# Altium project 项目.PrjPCB
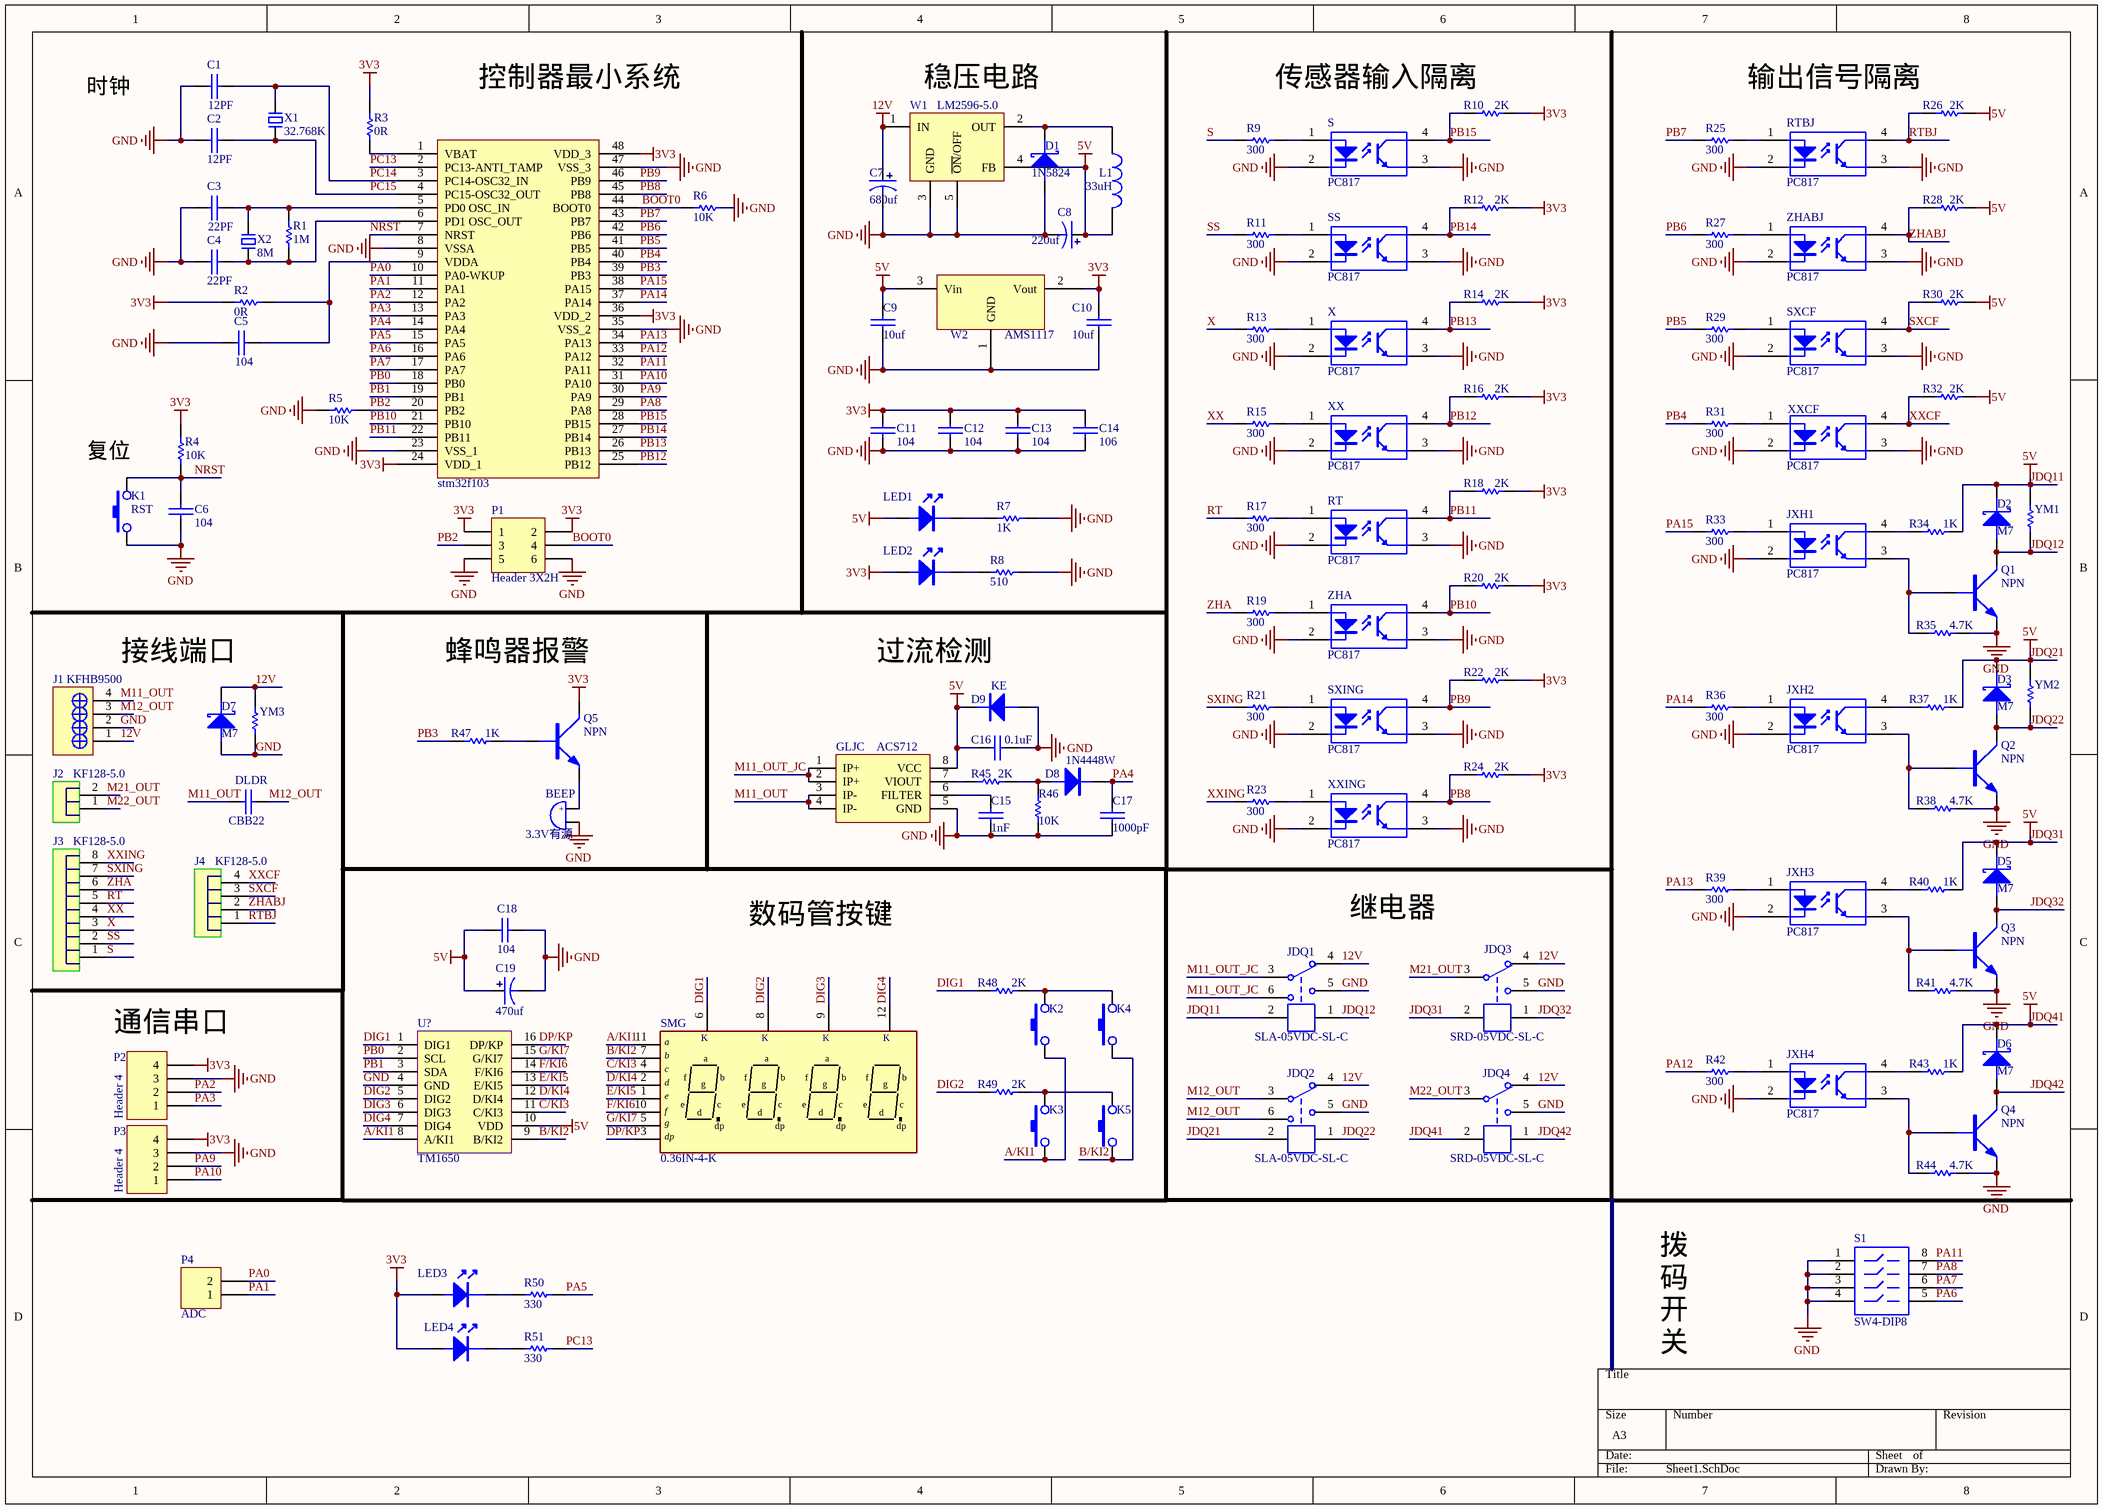
[diagram p0: Sheet1.SchDoc]
1 sheet, 135 parts. Net scope: global (net labels, ports and power ports of the same name join across sheets).
Board file: 项目.PcbDoc

## Sheet Sheet1.SchDoc
size A3

### Parts
?  stm32f103  [STM32F103_48_2]
BEEP  3.3V有源  [BEEP 5x9x5.5]
C1  12PF  [0805C]
C2  12PF  [0805C]
C3  22PF  [0805C]
C4  22PF  [0805C]
C5  104  [0805C]
C6  104  [0805C]
C7  680uf  [CM F(10*10.2)]
C8  220uf  [CM D(6.3*7.7)]
C9  10uf  [0805C]
C10  10uf  [0805C]
C11  104  [0805C]
C12  104  [0805C]
C13  104  [0805C]
C14  106  [0805C]
C15  1nF  [0805C]
C16  0.1uF  [0805C]
C17  1000pF  [0805C]
C18  104  [0805C]
C19  470uf  [CM E(8*10.2)]
D1  1N5824  [SMA/DO-214AC]
D2  M7  [SMA/DO-214AC]
D3  M7  [SMA/DO-214AC]
D5  M7  [SMA/DO-214AC]
D6  M7  [SMA/DO-214AC]
D7  M7  [SMA/DO-214AC]
D8  1N4448W  [SOD-123]
D9  KE  [SMB/DO-214AA]
DLDR  CBB22  [CBB 20*23*6]
GLJC  ACS712  [SOP8]
J1  KFHB9500  [KFHB9500-4P]
J2  KF128-5.0  [KF128-5.08-2P]
J3  KF128-5.0  [KF128-5.08-8P]
J4  KF128-5.0  [KF128-5.08-4P]
JDQ1  SLA-05VDC-SL-C  [SLA-xxVDC-SL-C]
JDQ2  SLA-05VDC-SL-C  [SLA-xxVDC-SL-C]
JDQ3  SRD-05VDC-SL-C  [SRD-C_B]
JDQ4  SRD-05VDC-SL-C  [SRD-C_B]
JXH1  PC817  [SMD_PC817]
JXH2  PC817  [SMD_PC817]
JXH3  PC817  [SMD_PC817]
JXH4  PC817  [SMD_PC817]
K1  RST  [SMD-3X6X2.5]
K2  (no value)  [SMD-3X6X2.5]
K3  (no value)  [SMD-3X6X2.5]
K4  (no value)  [SMD-3X6X2.5]
K5  (no value)  [SMD-3X6X2.5]
L1  33uH  [CDRH74]
LED1  (no value)  [LED-0805B]
LED2  (no value)  [LED-0805B]
LED3  (no value)  [LED-0805B]
LED4  (no value)  [LED-0805B]
P1  Header 3X2H  [HDR2.54-M-LS-2x3P]
P2  Header 4  [HDR2.54-LI-4P]
P3  Header 4  [HDR2.54-LI-4P]
P4  ADC  [HDR2.54-LI-2P]
Q1  NPN  [SOT-23]
Q2  NPN  [SOT-23]
Q3  NPN  [SOT-23]
Q4  NPN  [SOT-23]
Q5  NPN  [SOT-23]
R1  1M  [0805R]
R2  0R  [0805R]
R3  0R  [0805R]
R4  10K  [0805R]
R5  10K  [0805R]
R6  10K  [0805R]
R7  1K  [0805R]
R8  510  [0805R]
R9  300  [0805R]
R10  2K  [0805R]
R11  300  [0805R]
R12  2K  [0805R]
R13  300  [0805R]
R14  2K  [0805R]
R15  300  [0805R]
R16  2K  [0805R]
R17  300  [0805R]
R18  2K  [0805R]
R19  300  [0805R]
R20  2K  [0805R]
R21  300  [0805R]
R22  2K  [0805R]
R23  300  [0805R]
R24  2K  [0805R]
R25  300  [0805R]
R26  2K  [0805R]
R27  300  [0805R]
R28  2K  [0805R]
R29  300  [0805R]
R30  2K  [0805R]
R31  300  [0805R]
R32  2K  [0805R]
R33  300  [0805R]
R34  1K  [0805R]
R35  4.7K  [0805R]
R36  300  [0805R]
R37  1K  [0805R]
R38  4.7K  [0805R]
R39  300  [0805R]
R40  1K  [0805R]
R41  4.7K  [0805R]
R42  300  [0805R]
R43  1K  [0805R]
R44  4.7K  [0805R]
R45  2K  [0805R]
R46  10K  [0805R]
R47  1K  [0805R]
R48  2K  [0805R]
R49  2K  [0805R]
R50  330  [0805R]
R51  330  [0805R]
RT  PC817  [SMD_PC817]
RTBJ  PC817  [SMD_PC817]
S  PC817  [SMD_PC817]
S1  SW4-DIP8  [SMD-4P]
SMG  0.36IN-4-K  [0.36IN-4P]
SS  PC817  [SMD_PC817]
SXCF  PC817  [SMD_PC817]
SXING  PC817  [SMD_PC817]
U?  TM1650  [SOP16]
W1  LM2596-5.0  [TO263-5A]
W2  AMS1117  [SOT223]
X  PC817  [SMD_PC817]
X1  32.768K  [OSC-3x8-LI]
X2  8M  [OSC HC-49S]
XX  PC817  [SMD_PC817]
XXCF  PC817  [SMD_PC817]
XXING  PC817  [SMD_PC817]
YM1  (no value)  [VDR 9D-4.5]
YM2  (no value)  [VDR 9D-4.5]
YM3  (no value)  [VDR 9D-4.5]
ZHA  PC817  [SMD_PC817]
ZHABJ  PC817  [SMD_PC817]

### Nets
3V3: ?.24(VDD_1) ?.36(VDD_2) ?.48(VDD_3) C10.2 C11.2 C12.2 C13.2 C14.2 LED2.1(A) LED3.1(A) LED4.1(A) P1.1 P1.2 P2.4 P3.4 Q5.C R2.2 R3.1 R4.1 R10.2 R12.2 R14.2 R16.2 R18.2 R20.2 R22.2 R24.2 W2.2(Vout)
12V: C7.1 D7.K J1.1 JDQ1.4 JDQ2.4 JDQ3.4 JDQ4.4 W1.1(IN) YM3.2
GND: ?.8(VSSA) ?.23(VSS_1) ?.35(VSS_2) ?.47(VSS_3) BEEP.2 C1.1 C2.1 C3.1 C4.1 C5.1 C6.1 C7.2 C8.2 C9.1 C10.1 C11.1 C12.1 C13.1 C14.1 C15.1 C16.1 C17.1 C18.1 C19.2 D1.A D7.A D9.A GLJC.5(GND) J1.2 JDQ1.5 JDQ2.5 JDQ3.5 JDQ4.5 JXH1.2(K) JXH2.2(K) JXH3.2(K) JXH4.2(K) K1.1 P1.5 P1.6 P2.3 P3.3 Q1.E Q2.E Q3.E Q4.E R5.2 R6.1 R7.1 R8.1 R35.2 R38.2 R41.2 R44.2 R46.2 RT.2(K) RT.3(E) RTBJ.2(K) RTBJ.3(E) S.2(K) S.3(E) S1.1 S1.2 S1.3 S1.4 SS.2(K) SS.3(E) SXCF.2(K) SXCF.3(E) SXING.2(K) SXING.3(E) U?.4(GND) W1.3(GND) W1.5(~{ON}/OFF) W2.1(GND) X.2(K) X.3(E) XX.2(K) XX.3(E) XXCF.2(K) XXCF.3(E) XXING.2(K) XXING.3(E) YM3.1 ZHA.2(K) ZHA.3(E) ZHABJ.2(K) ZHABJ.3(E)
JDQ11: C8.1 C9.2 C16.2 C18.2 C19.1 D2.K D3.K D5.K D6.K D9.K GLJC.8(VCC) JDQ1.2 JDQ2.2 JDQ3.2 JDQ4.2 L1.2 LED1.1(A) R26.2 R28.2 R30.2 R32.2 R34.2 R37.2 R40.2 R43.2 U?.10(VDD) W1.4(FB) W2.3(Vin) YM1.2 YM2.2  [also labelled 5V, JDQ21, JDQ31, JDQ41]
A/KI1: K2.1 K3.1 SMG.11 U?.8(A/KI1)
B/KI2: K4.1 K5.1 SMG.7 U?.9(B/KI2)
BOOT0: ?.44(BOOT0) P1.4 R6.2
C/KI3: SMG.4 U?.11(C/KI3)
D/KI4: SMG.2 U?.12(D/KI4)
DIG1: R48.1 SMG.6 U?.1(DIG1)
DIG2: R49.1 SMG.8 U?.5(DIG2)
DIG3: SMG.9 U?.6(DIG3)
DIG4: SMG.12 U?.7(DIG4)
DP/KP: SMG.3 U?.16(DP/KP)
E/KI5: SMG.1 U?.13(E/KI5)
F/KI6: SMG.10 U?.14(F/KI6)
G/KI7: SMG.5 U?.15(G/KI7)
JDQ12: D2.A JDQ1.1 Q1.C YM1.1
JDQ22: D3.A JDQ2.1 Q2.C YM2.1
JDQ32: D5.A JDQ3.1 Q3.C
JDQ42: D6.A JDQ4.1 Q4.C
M11_OUT: DLDR.1 GLJC.3(IP-) GLJC.4(IP-) J1.4
M11_OUT_JC: GLJC.1(IP+) GLJC.2(IP+) JDQ1.3 JDQ1.6
M12_OUT: DLDR.2 J1.3 JDQ2.3 JDQ2.6
M21_OUT: J2.2 JDQ3.3
M22_OUT: J2.1 JDQ4.3
NRST: ?.7(NRST) C6.2 K1.3 R4.2
PA0: ?.10(PA0-WKUP) P4.2
PA1: ?.11(PA1) P4.1
PA2: ?.12(PA2) P2.2
PA3: ?.13(PA3) P2.1
PA4: ?.14(PA4) C17.2 D8.K
PA5: ?.15(PA5) R50.1
PA6: ?.16(PA6) S1.5
PA7: ?.17(PA7) S1.6
PA8: ?.29(PA8) S1.7
PA9: ?.30(PA9) P3.2
PA10: ?.31(PA10) P3.1
PA11: ?.32(PA11) S1.8
PA12: ?.33(PA12) R42.1
PA13: ?.34(PA13) R39.1
PA14: ?.37(PA14) R36.1
PA15: ?.38(PA15) R33.1
PB0: ?.18(PB0) U?.2(SCL)
PB1: ?.19(PB1) U?.3(SDA)
PB2: ?.20(PB2) P1.3 R5.1
PB3: ?.39(PB3) R47.1
PB4: ?.40(PB4) R31.1
PB5: ?.41(PB5) R29.1
PB6: ?.42(PB6) R27.1
PB7: ?.43(PB7) R25.1
PB8: ?.45(PB8) R24.1 XXING.4(C)
PB9: ?.46(PB9) R22.1 SXING.4(C)
PB10: ?.21(PB10) R20.1 ZHA.4(C)
PB11: ?.22(PB11) R18.1 RT.4(C)
PB12: ?.25(PB12) R16.1 XX.4(C)
PB13: ?.26(PB13) R14.1 X.4(C)
PB14: ?.27(PB14) R12.1 SS.4(C)
PB15: ?.28(PB15) R10.1 S.4(C)
PC13: ?.2(PC13-ANTI_TAMP) R51.1
PC14: ?.3(PC14-OSC32_IN) C1.2 X1.2
PC15: ?.4(PC15-OSC32_OUT) C2.2 X1.1
RT: J3.5 R17.1
RTBJ: J4.1 R26.1 RTBJ.4(C)
S: J3.1 R9.1
SS: J3.2 R11.1
SXCF: J4.3 R30.1 SXCF.4(C)
SXING: J3.7 R21.1
X: J3.3 R13.1
XX: J3.4 R15.1
XXCF: J4.4 R32.1 XXCF.4(C)
XXING: J3.8 R23.1
ZHA: J3.6 R19.1
ZHABJ: J4.2 R28.1 ZHABJ.4(C)
Net?_1: ?.1(VBAT) R3.2
Net?_5: ?.5(PD0_OSC_IN) C3.2 R1.2 X2.2
Net?_6: ?.6(PD1_OSC_OUT) C4.2 R1.1 X2.1
Net?_9: ?.9(VDDA) C5.2 R2.1
NetBEEP_1: BEEP.1 Q5.E
NetC15_2: C15.2 GLJC.6(FILTER)
NetD1_K: D1.K L1.1 W1.2(OUT)
NetD8_A: D8.A R45.1 R46.1
NetGLJC_7: GLJC.7(VIOUT) R45.2
NetJXH1_1: JXH1.1(A) R33.2
NetJXH1_3: JXH1.3(E) Q1.B R35.1
NetJXH1_4: JXH1.4(C) R34.1
NetJXH2_1: JXH2.1(A) R36.2
NetJXH2_3: JXH2.3(E) Q2.B R38.1
NetJXH2_4: JXH2.4(C) R37.1
NetJXH3_1: JXH3.1(A) R39.2
NetJXH3_3: JXH3.3(E) Q3.B R41.1
NetJXH3_4: JXH3.4(C) R40.1
NetJXH4_1: JXH4.1(A) R42.2
NetJXH4_3: JXH4.3(E) Q4.B R44.1
NetJXH4_4: JXH4.4(C) R43.1
NetK2_3: K2.3 K4.3 R48.2
NetK3_3: K3.3 K5.3 R49.2
NetLED1_2: LED1.2(K) R7.2
NetLED2_2: LED2.2(K) R8.2
NetLED3_2: LED3.2(K) R50.2
NetLED4_2: LED4.2(K) R51.2
NetQ5_B: Q5.B R47.2
NetR9_2: R9.2 S.1(A)
NetR11_2: R11.2 SS.1(A)
NetR13_2: R13.2 X.1(A)
NetR15_2: R15.2 XX.1(A)
NetR17_2: R17.2 RT.1(A)
NetR19_2: R19.2 ZHA.1(A)
NetR21_2: R21.2 SXING.1(A)
NetR23_2: R23.2 XXING.1(A)
NetR25_2: R25.2 RTBJ.1(A)
NetR27_2: R27.2 ZHABJ.1(A)
NetR29_2: R29.2 SXCF.1(A)
NetR31_2: R31.2 XXCF.1(A)

### Notes on the sheet
- 时钟
- 控制器最小系统
- 稳压电路
- (near R10) 传感器输入隔离
- (near R26) 输出信号隔离
- 复位
- 接线端口
- (near Q5) 蜂鸣器报警
- (near D9) 过流检测
- 数码管按键
- 继电器
- (near P2) 通信串口
- 拨码开关
- (in symbol 0.36IN-4-K) K; a; b; c; f; d; g; e; dp
- (in symbol BEEP) +

### Library data of the parts
BEEP = BEEP
C1-C6 C9-C18 DLDR = CAP: 无极性电容
C7 C8 C19 = SMD_ECAP: 贴片电解电容
D1-D3 D5-D7 = DIODE SCHOTTKY: 肖特基二极管
D8 D9 = DIODE: 普通二极管
J1 = KFHB9500-4P
J2 = KF128-2P
J3 = KF128-8P
J4 = KF128-4P
JDQ1 JDQ2 = SLA-05VDC-SL-C: 5V一组转换
JDQ3 JDQ4 = SRD-05VDC-SL-C: 5V一组转换
JXH1-JXH4 RT RTBJ S SS SXCF SXING X XX XXCF XXING ZHA ZHABJ = PC817: 线性光耦
K1-K5 = KEY
L1 = INDUCTOR
LED1-LED4 = LED
P1 = Header 3X2H: Header, 3-Pin, Dual row, Right Angle; LatestRevisionDate: 17-Jul-2002; LatestRevisionNote: Re-released for DXP Platform.; Publisher: Altium Limited
P2 P3 = Header 4: Header, 4-Pin; LatestRevisionDate: 17-Jul-2002; LatestRevisionNote: Re-released for DXP Platform.; Publisher: Altium Limited
P4 = Header 2: Header, 2-Pin; LatestRevisionDate: 17-Jul-2002; LatestRevisionNote: Re-released for DXP Platform.; Publisher: Altium Limited
Q1-Q5 = NPN: NPN三极管
R1-R51 YM1-YM3 = RES
SMG = 0.36IN-4-K: 4位0.36寸共阴数码管
W1 = LM2596-5.0: DC降压芯片
W2 = AMS1117: 三端稳压芯片
X1 X2 = XTAL-2P: 2脚无源脚晶振